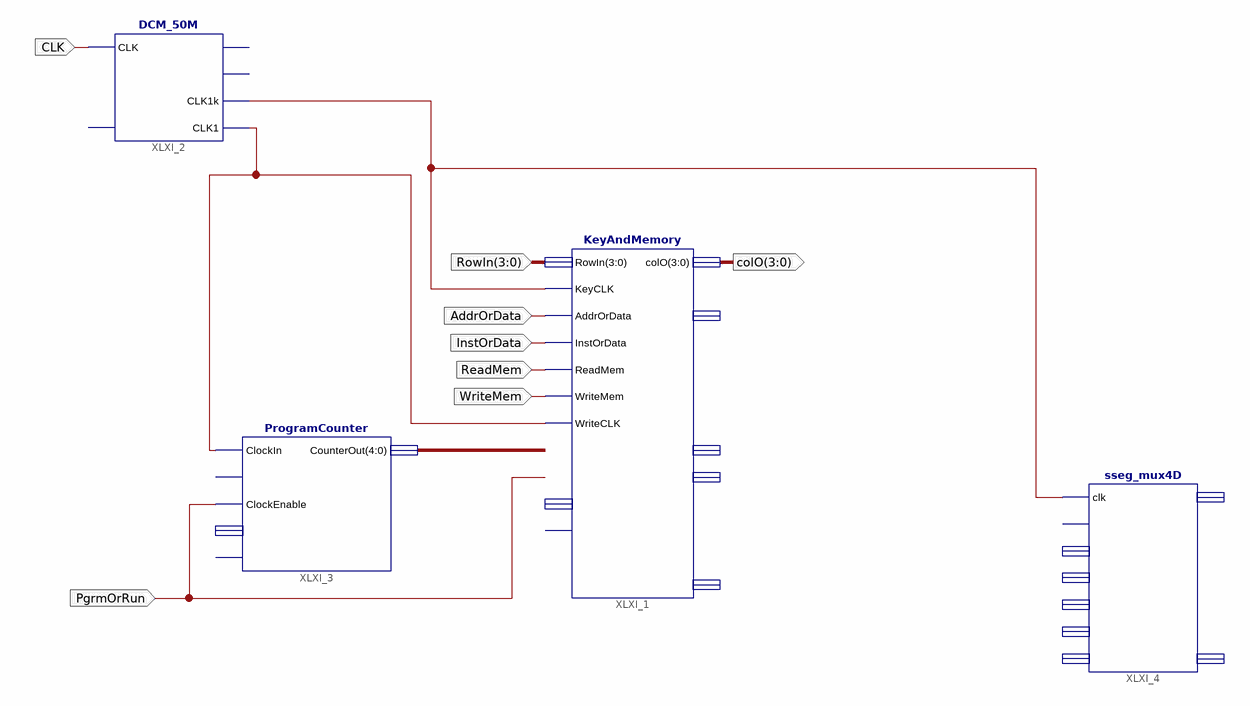
[diagram p0: schematic sheet 1]
// Xilinx ISE schematic MainArea.sch (spartan3e) as structural Verilog: 4 symbols, 8 ports
module MainArea (
  input  CLK,
  input  PgrmOrRun,
  input  AddrOrData,
  input  ReadMem,
  input  InstOrData,
  input  WriteMem,
  input  [3:0] RowIn,
  output [3:0] colO
);

  wire XLXN_2, XLXN_3;
  wire [4:0] XLXN_10;

  KeyAndMemory XLXI_1 (
    .RowIn(RowIn), .KeyCLK(XLXN_2), .AddrOrData(AddrOrData), .ReadMem(ReadMem), .InstOrData(InstOrData),
    .WriteCLK(XLXN_3), .WriteMem(WriteMem), .colO(colO));  // open: RunCount, PgrmOrRun, DataRam, InstRam, AddrO, XLXN_79
  DCM_50M XLXI_2 (.CLK(CLK), .CLK1k(XLXN_2), .CLK1(XLXN_3));  // open: RST, CLK1M, CLK10k
  ProgramCounter XLXI_3 (
    .ClockIn(XLXN_3), .ClockEnable(PgrmOrRun), .CounterOut(XLXN_10));  // open: ClearIn, CountLoad, PushLoad
  sseg_mux4D XLXI_4 (.clk(XLXN_2));  // open: rb_in, hexD, hexC, hexB, hexA, dp_in, anO, ssegO
endmodule
